# Altium schematic sheet ups.SchDoc
size A3; SheetNumber: 1; SheetTotal: 1
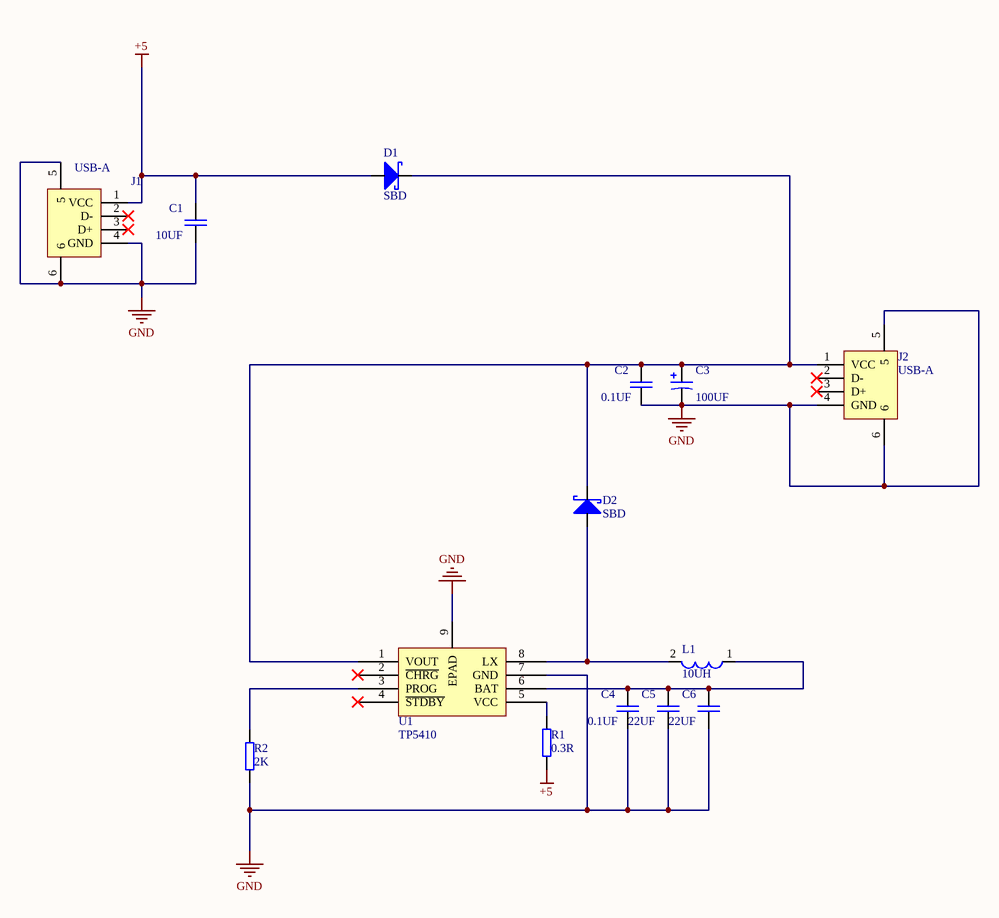
[diagram p0: ups.SchDoc]

## Parts
C1  10UF  [1206]
C2  0.1UF  [0805]
C3  100UF  [CAP-SMD-3.5X2.8]
C4  0.1UF  [0805]
C5  22UF  [1206]
C6  22UF  [1206]
D1  SBD  [SMA]
D2  SBD  [SMA]
J1  USB-A  [USB-A-MALE-DD]
J2  USB-A  [USB-A-FEMALE-DD]
L1  10UH  [IND-0630]
R1  0.3R  [1210]
R2  2K  [0603]
U1  TP5410  [ESOP-8]

## Nets
+5: C1.1 D1.2 J1.1(VCC) R1.2
GND: C1.2 C2.2 C3.2 C4.2 C5.2 C6.2 J1.4(GND) J1.5 J1.6 J2.4(GND) J2.5 J2.6 R2.1 U1.7(GND) U1.9(EPAD)
NetC2_1: C2.1 C3.1 D1.1 D2.1 J2.1(VCC) U1.1(VOUT)
NetC4_1: C4.1 C5.1 C6.1 L1.1 U1.6(BAT)
NetD2_2: D2.2 L1.2 U1.8(LX)
NetR1_1: R1.1 U1.5(VCC)
NetR2_2: R2.2 U1.3(PROG)

Not connected (* = marked no-connect by the designer): J1 2(D-)* 3(D+)*; J2 2(D-)* 3(D+)*; U1 2(~{CHRG})* 4(~{STDBY})*

## Library data of the parts
C1 C2 C4-C6 = CAP: Capacitor
C3 = CAP-ELC
D1 D2 = SBD: SchottkyBarrierDiode
L1 = IND: Inductor
R1 R2 = RES: Resistor
U1 = TP5400